# EAGLE design Interlock (EAGLE 6.6.0)
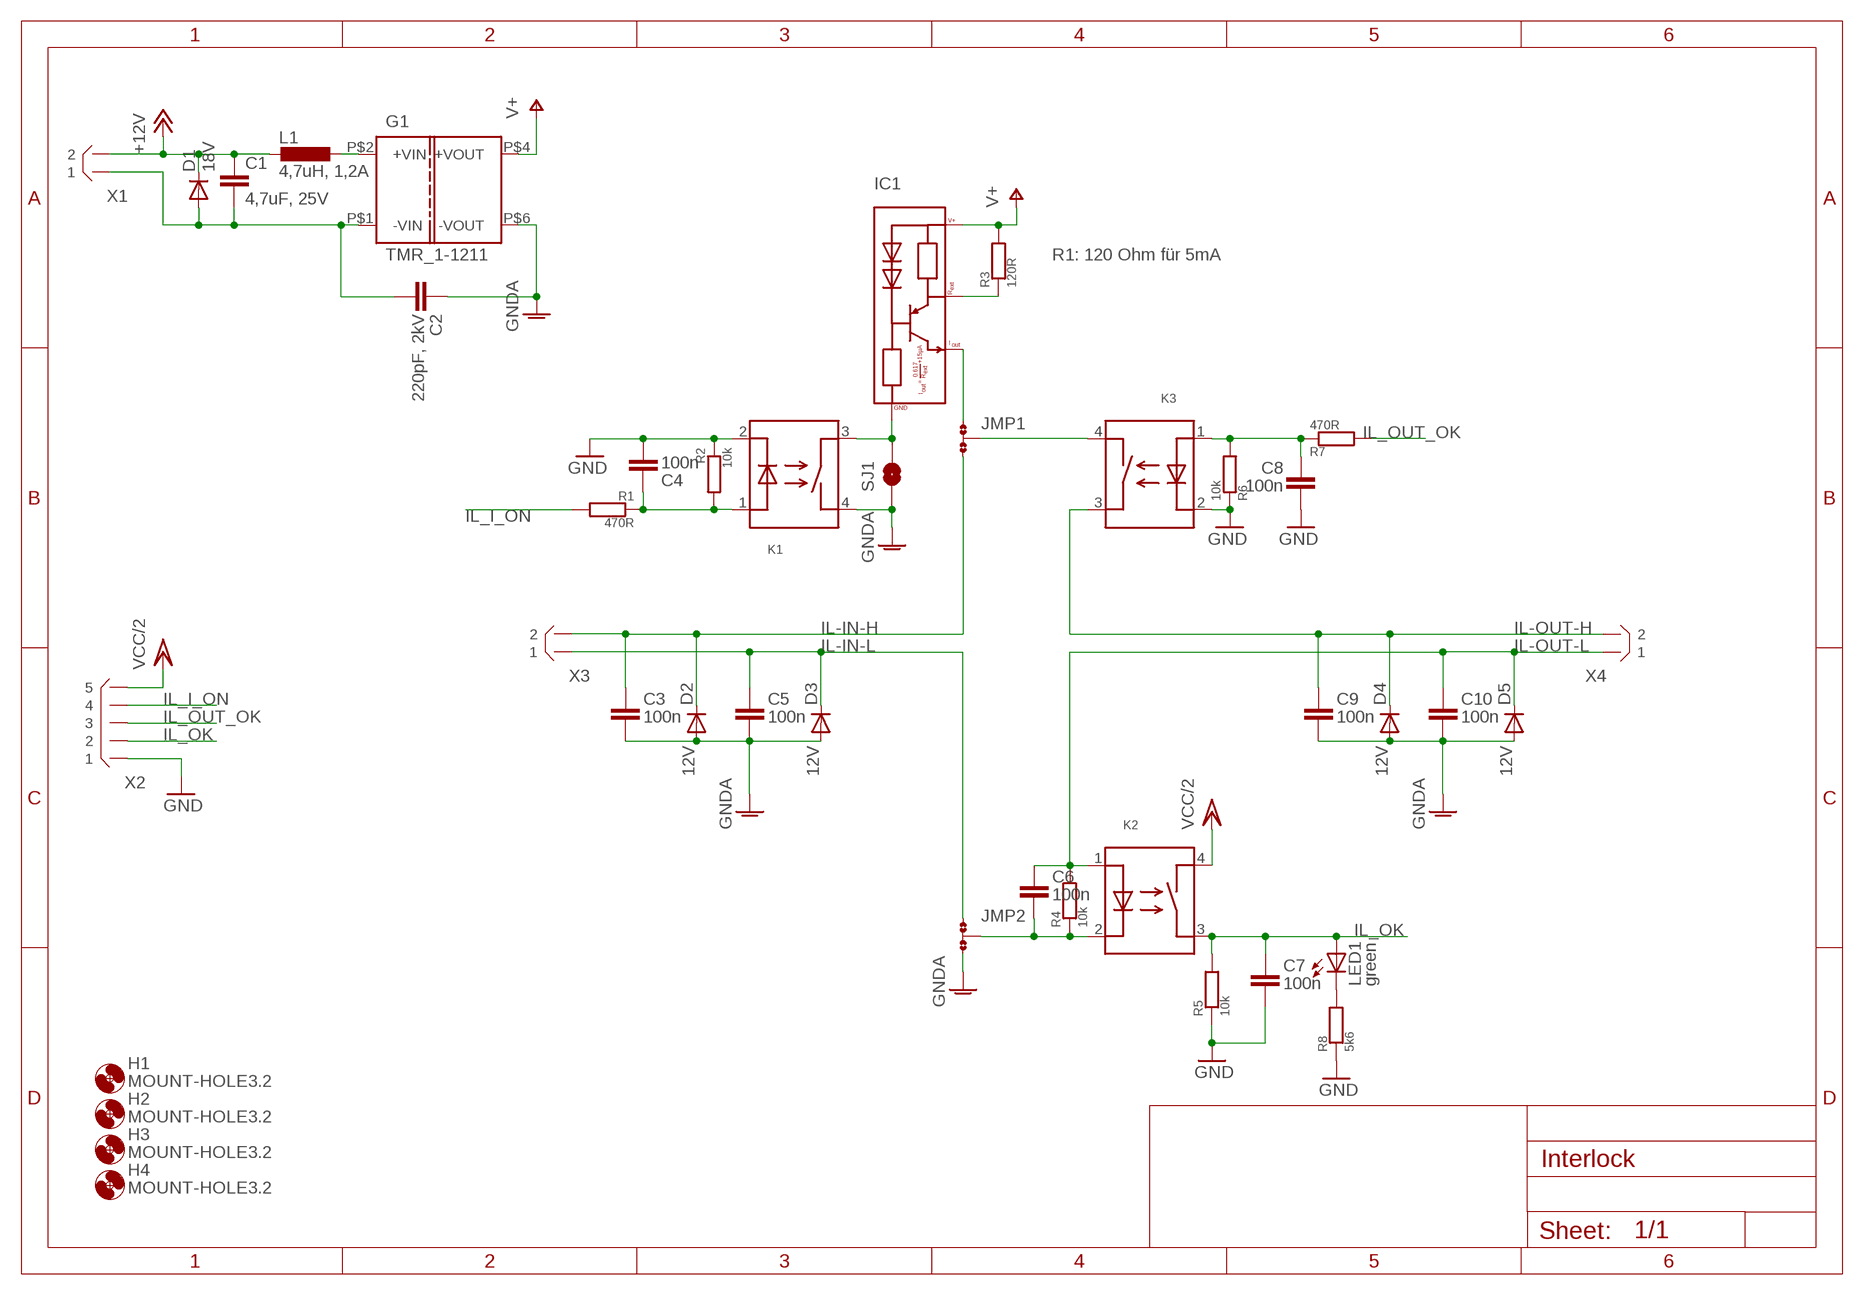
[diagram p0: schematic, sheet 1]

## Parts
C1  4,7uF, 25V  C-EUC0805  [C0805]
C2  220pF, 2kV  CC1210_HV  [C1210_HV]
C3  100n  CSTD  [C0805]
C4  100n  CSTD  [C0805]
C5  100n  CSTD  [C0805]
C6  100n  CSTD  [C0805]
C7  100n  CSTD  [C0805]
C8  100n  CSTD  [C0805]
C9  100n  CSTD  [C0805]
C10  100n  CSTD  [C0805]
D1  18V  DIODE-DO214AA  [DO214AA]
D2  12V  DIODE-DO214AA  [DO214AA]
D3  12V  DIODE-DO214AA  [DO214AA]
D4  12V  DIODE-DO214AA  [DO214AA]
D5  12V  DIODE-DO214AA  [DO214AA]
G1  TMR_1-1211  TMR_1-1  [TMR_1-??1?]
H1  MOUNT-HOLE3.2  [3,2]
H2  MOUNT-HOLE3.2  [3,2]
H3  MOUNT-HOLE3.2  [3,2]
H4  MOUNT-HOLE3.2  [3,2]
IC1  PSSI2021SAY  [SOT353]
JMP1  0R-JUMPA  [A0R-JMP]
JMP2  0R-JUMPA  [A0R-JMP]
K1  ASSR-1218  [SO-4]
K2  ASSR-1218  [SO-4]
K3  ASSR-1218  [SO-4]
L1  4,7uH, 1,2A  L-EUL3225M  [L3225M]
LED1  green  LEDCHIPLED_0805  [CHIPLED_0805]
R1  470R  R  [R0805]
R2  10k  R  [R0805]
R3  120R  R  [R0805]
R4  10k  R  [R0805]
R5  10k  R  [R0805]
R6  10k  R  [R0805]
R7  470R  R  [R0805]
R8  5k6  R  [R0805]
SJ1  SOLDERJUMPERNO  [SJ_2S-NO]
X1  B2B-XH  [B2B-XH]
X2  B5B-XH  [B5B-XH]
X3  B2B-XH  [B2B-XH]
X4  B2B-XH  [B2B-XH]

## Nets
+12V: C1.1 D1.C L1.2 X1.P$2
GND: C4.1 C7.1 C8.1 K1.2(I-) K3.2(I-) R2.1 R5.1 R6.1 R8.1 X2.P$1
GNDA: C2.P$2 C3.1 C5.1 C9.1 C10.1 D2.A D3.A D4.A D5.A G1.P$6(-VOUT) JMP2.1 K1.4(O1) SJ1.1
IL-IN-H: C3.2 D2.C JMP1.3 X3.P$2
IL-IN-L: C5.2 D3.C JMP2.3 X3.P$1
IL-OUT-H: C9.2 D4.C K3.3(O2) X4.P$2
IL-OUT-L: C6.2 C10.2 D5.C K2.1(I+) R4.2 X4.P$1
IL_I_ON: R1.2 X2.P$4
IL_OK: C7.2 K2.3(O2) LED1.A R5.2 X2.P$2
IL_OUT_OK: R7.2 X2.P$3
N$1: IC1.4(REXT) R3.1
N$2: G1.P$2(+VIN) L1.1
N$3: C8.2 K3.1(I+) R6.2 R7.1
N$4: JMP1.2 K3.4(O1)
N$5: C1.2 C2.P$1 D1.A G1.P$1(-VIN) X1.P$1
N$6: IC1.2(IOUT) JMP1.1
N$7: C6.1 JMP2.2 K2.2(I-) R4.1
N$8: IC1.3(GND) K1.3(O2) SJ1.2
N$10: C4.2 K1.1(I+) R1.1 R2.2
N$29: LED1.C R8.2
V+: G1.P$4(+VOUT) IC1.5(VSS) R3.2
VCC/2: K2.4(O1) X2.P$5

## Notes on the sheet
- R1: 120 Ohm für 5mA

## Library data of the parts
C1 = rcl:C-EU: CAPACITOR, European symbol
C2-C10 = useful:C
D1-D5 = diode:DIODE-: DIODE
G1 = traco-power:TMR_1-??1?
H1-H4 = holes:MOUNT-HOLE: MOUNTING HOLE with drill center marker
IC1 = nxp:PSSI2021SAY
JMP1 JMP2 = jumper:0R-JUMP: SMD 0R 0805 Jumper
K1-K3 = special:ASSR-1218
L1 = rcl:L-EU: INDUCTOR, European symbol
LED1 = led:LED: LED OSRAM: - CHIPLED LG R971, LG N971, LY N971, LG Q971, LY Q971, LO R971, LY R971 LH N974, LH R974 LS Q976, LO Q976, LY Q976 LO Q996 - Hyper CHIPLED LW Q18S LB Q993, LB Q99A, LB R99A - SideLED LS A670, LO A670, LY A670, LG A670, LP A670 LB A673, LV A673, LT A673, LW A673 LH A674 LY A675 LS A676, LA A676, LO A676, LY A676, LW A676 LS A679, LY A679, LG A679 - Hyper Micro SIDELED® LS Y876, LA Y876, LO Y876, LY Y876 LT Y87S - SmartLED LW L88C, LW L88S LB L89C, LB L89S, LG L890 LS L89K, LO L89K, LY L89K LS L896, LA L896, LO L896, LY L896 - TOPLED LS T670, LO T670, LY T670, LG T670, LP T670 LSG T670, LSP T670, LSY T670, LOP T670, LYG T670 LG T671, LOG T671, LSG T671 LB T673, LV T673, LT T673, LW T673 LH T674 LS T676, LA T676, LO T676, LY T676, LB T676, LH T676, LSB T676, LW T676 LB T67C, LV T67C, LT T67C, LS T67K, LO T67K, LY T67K, LW E67C LS E67B, LA E67B, LO E67B, LY E67B, LB E67C, LV E67C, LT E67C LW T67C LS T679, LY T679, LG T679 LS T770, LO T770, LY T770, LG T770, LP T770 LB T773, LV T773, LT T773, LW T773 LH T774 LS E675, LA E675, LY E675, LS T675 LS T776, LA T776, LO T776, LY T776, LB T776 LHGB T686 LT T68C, LB T68C - Hyper Mini TOPLED® LB M676 - Mini TOPLED Santana® LG M470 LS M47K, LO M47K, LY M47K Source: http://www.osram.convergy.de LUXEON: - LUMILED® LXK2-PW12-R00, LXK2-PW12-S00, LXK2-PW14-U00, LXK2-PW14-V00 LXK2-PM12-R00, LXK2-PM12-S00, LXK2-PM14-U00 LXK2-PE12-Q00, LXK2-PE12-R00, LXK2-PE12-S00, LXK2-PE14-T00, LXK2-PE14-U00 LXK2-PB12-K00, LXK2-PB12-L00, LXK2-PB12-M00, LXK2-PB14-N00, LXK2-PB14-P00, LXK2-PB14-Q00 LXK2-PR12-L00, LXK2-PR12-M00, LXK2-PR14-Q00, LXK2-PR14-R00 LXK2-PD12-Q00, LXK2-PD12-R00, LXK2-PD12-S00 LXK2-PH12-R00, LXK2-PH12-S00 LXK2-PL12-P00, LXK2-PL12-Q00, LXK2-PL12-R00 Source: www.luxeon.com KINGBRIGHT: KA-3528ASYC Source: www.kingbright.com
R1-R8 = useful:R
SJ1 = jumper:SOLDERJUMPER: Solder Jumper Standard SMD solder jumper. Used to automate production. Two varients : Normally Open and Normally Closed are the same, but have different paste layers. NC will have a large amount of paste and should jumper during reflow.
X1 X3 X4 = con-jst-xh:?2B-XH
X2 = con-jst-xh:?5B-XH

## Board
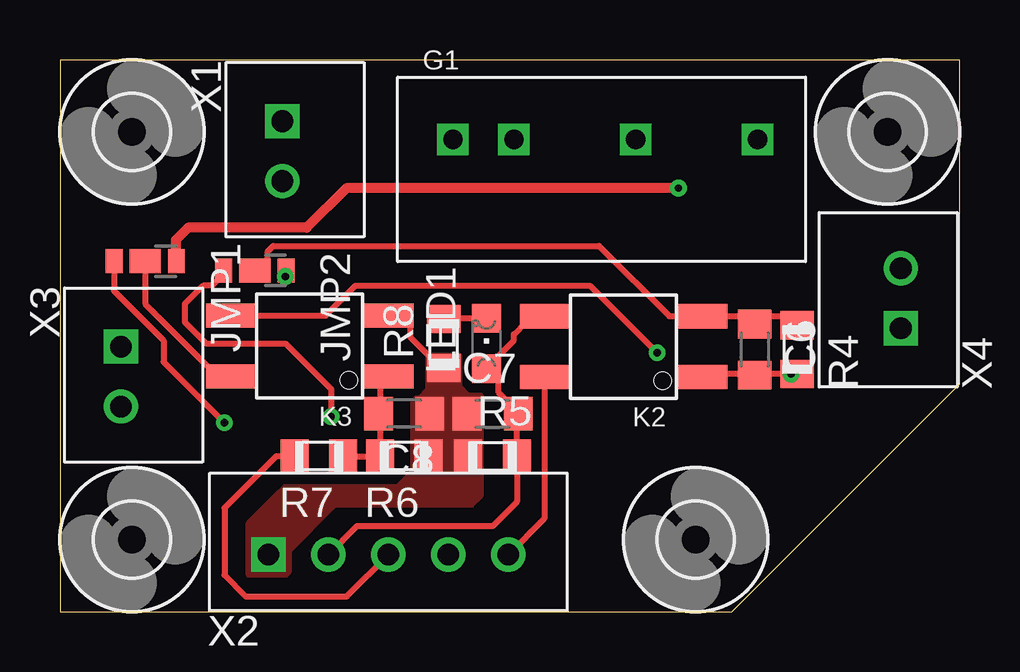
[diagram p1: board, top side]
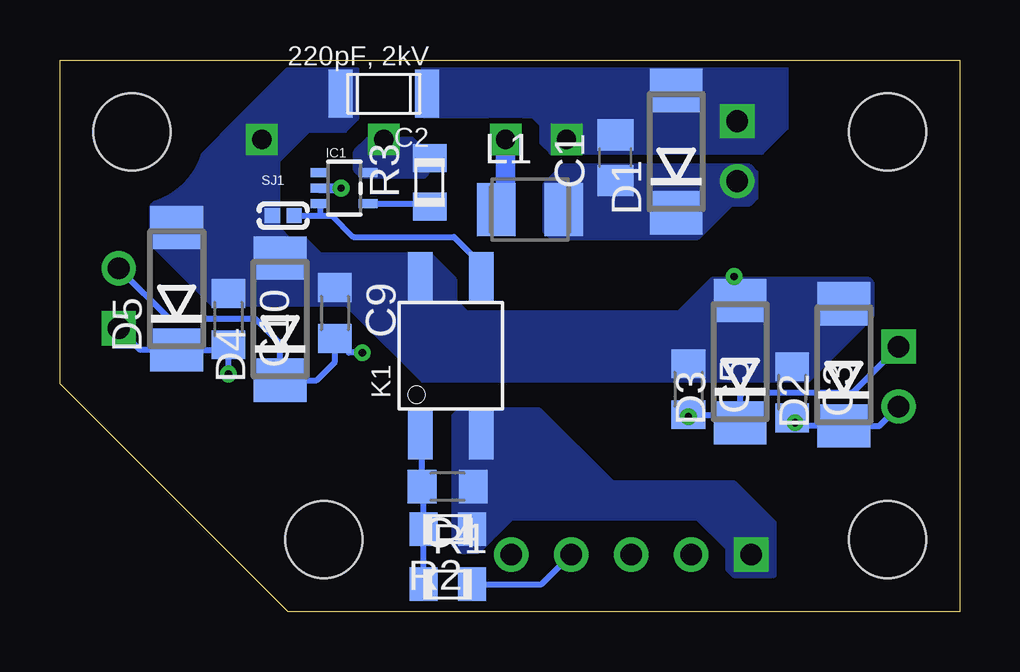
[diagram p2: board, bottom side, seen from below]

Size 37.5 x 23 mm. Coordinates in mm from the lower left corner, seen from the top.
Outline: 0,0 28,0 37.5,9.5 37.5,23 0,23 0,0
Copper layers (1+2*15+16): Top 0.035mm / dielectric 0.2mm / Route2 0.035mm / dielectric 0.5mm / Route15 0.035mm / dielectric 0.2mm / Bottom 0.035mm
Design rules "ats_35u_4layer_2 *": minimum track width 10mil, minimum drill 0.2mm, track to track 10mil, track to pad 10mil, pad to pad 10mil, via to via 10mil, smd to smd 10mil, copper to edge 0.3mm, drill to drill 8mil, minimum pad ring 10mil, minimum via ring 0.2mm, stop-mask expansion 4mil, vias tented up to drill 0mil, thermal gap 10mil

### Footprints (pad centres in the part's own frame; a part is rotated, then mirrored left to right if it is on the bottom)
C0805 = smd 1.3 x 1.5: 1 -0.95,0; 2 0.95,0
C1210_HV = smd 1 x 2: P$1 -1.8,0; P$2 1.8,0
C0805' = smd 1.2 x 1.4: 1 -1.066,0; 2 1.066,0
DO214AA = smd 1.8 x 2.2: A 2.55,0; C -2.55,0
TMR_1-??1? = drill 0.8 square: P$1 0,0; P$2 2.54,0; P$4 7.62,0; P$6 12.7,0
3,2 = hole 3.2: 0,0
SOT353 = smd 0.38 x 0.8: 1 -0.65,-1; 2 0,-1; 3 0.65,-1; 4 0.65,1; 5 -0.65,1
A0R-JMP = smd 1 x 0.7: 1 0,1.3; 3 0,-1.3 | smd 1 x 1.3: 2 0,0
SO-4 = smd 1.016 x 2.032: 1 -1.27,-3.302; 2 1.27,-3.302; 3 1.27,3.302; 4 -1.27,3.302
L3225M = smd 1.6 x 2.2: 1 -1.4,0; 2 1.4,0
CHIPLED_0805 = smd 1.2 x 1.2: A 0,-1.05; C 0,1.05
R0805 = smd 1.168 x 1.397: 1 -1.016,0; 2 1.016,0
SJ_2S-NO = smd 0.635 x 0.635: 1 -0.45,0; 2 0.45,0
B2B-XH = drill 0.9 pad 1.422 square: P$1 0,0 | drill 0.9 pad 1.422: P$2 2.5,0
B5B-XH = drill 0.9 pad 1.422 square: P$1 0,0 | drill 0.9 pad 1.422: P$2 2.5,0; P$3 5,0; P$4 7.5,0; P$5 10,0

### Placement (x,y rotation side)
C1  14.35,18.92 90 bottom
C2  24,21.59 180 bottom
C3  100n  [C0805']  6.99,9.14 270 bottom
C4  100n  [C0805']  21.34,5.21 180 bottom
C5  100n  [C0805']  11.3,9.27 270 bottom
C6  100n  [C0805']  28.96,10.92 270 top
C7  100n  [C0805']  18.03,8.26 0 top
C8  100n  [C0805']  14.35,8.26 180 top
C9  100n  [C0805']  26.04,12.45 270 bottom
C10  100n  [C0805']  30.48,12.19 270 bottom
D1  11.81,19.18 90 bottom
D2  4.83,10.29 90 bottom
D3  9.14,10.41 90 bottom
D4  28.32,12.19 90 bottom
D5  32.64,13.46 90 bottom
G1  16.38,19.68 0 top
H1  3,3 0 top
H2  26.5,3 0 top
H3  3,20 0 top
H4  34.5,20 0 top
IC1  25.65,17.65 270 bottom
JMP1  3.56,14.61 270 top
JMP2  8.13,14.22 270 top
K1  21.21,10.67 0 bottom
K2  23.5,11.05 90 top
K3  10.41,11.07 90 top
L1  17.91,16.76 0 bottom
LED1  17.78,11.18 0 top
R1  21.34,1.14 0 bottom
R2  21.34,3.43 180 bottom
R3  22.09,17.89 90 bottom
R4  30.73,10.92 270 top
R5  18.03,6.48 0 top
R6  14.35,6.48 180 top
R7  10.79,6.48 180 top
R8  16,11.18 90 top
SJ1  28.19,16.51 0 bottom
X1  9.27,20.45 270 top
X2  8.69,2.37 0 top
X3  2.54,11.05 270 top
X4  35.05,11.81 90 top

### Tracks (layer width: path | path; a pad name or v marks a point on that pad's centre or on a via)
+12V
  pour Bottom (isolate 0.254, no thermals): 8.76,18.54 16.51,18.54 17.27,17.78 17.27,15.88 17.02,15.62 10.92,15.62 9.53,17.02 8.76,17.02 8.51,17.27 8.51,18.29
GND
  Top 0.254: R8.1 15.88,10.16 14.61,11.43 14.61,12.06 14.48,12.19 13.87,12.19 K3.2
  pour Top (no thermals): 14.86,8.89 14.99,8.89 15.37,9.27 15.37,10.67 16.64,10.67 16.64,9.4 17.02,9.02 17.53,9.02 17.53,5.84 17.53,4.83 17.14,4.45 11.43,4.45 9.53,2.54 9.53,1.65 9.4,1.52 7.87,1.52 7.87,3.68 9.02,4.83 9.4,5.21 14.1,5.21 14.73,5.84 14.73,8.76
  pour Bottom (no thermals): 7.75,1.52 7.75,3.68 9.4,5.33 14.48,5.33 17.53,8.38 20.83,8.38 21.08,8.13 21.08,2.79 20.83,2.54 20.07,2.54 18.67,3.94 10.92,3.94 9.65,2.67 9.65,1.78 9.4,1.52
GNDA  (via drill 0.3)
  Top 0.254: JMP2.1 v9.4,13.97
  Bottom 0.254: v9.4,13.97 9.4,13.22 D3.A
  pour Bottom (no thermals): 3.68,13.72 3.68,12.32 6.35,9.65 22.35,9.65 25.15,12.45 25.53,12.83 31.11,12.83 33.66,15.37 33.66,16.89 27.81,22.73 25.27,22.73 25.15,22.61 25.15,20.57 25.65,20.07 26.92,20.07 27.18,20.07 28.45,18.8 28.45,16 27.94,15.49 27.3,15.49 26.67,14.86 22.1,14.86 21.08,13.84 21.08,12.95 20.57,12.45 19.56,12.45 11.68,12.45 10.29,13.84 3.81,13.84
IL-IN-H  (via drill 0.3)
  Top 0.254: JMP1.3 2.26,13.37 4.32,11.3 4.32,10.41 v6.86,7.87
  Bottom 0.254: C3.2 6.93,8.13 v6.86,7.87 6.47,7.74 D2.C 3.35,7.74 X3.P$2
IL-IN-L  (via drill 0.3)
  Top 0.254: JMP2.3 6.83,14.07 6.35,13.59 5.97,13.59 5.21,12.83 5.21,12.06 6.1,11.18 9.4,11.18 11.3,9.27 v11.3,8.13
  Bottom 0.254: X3.P$1 4.45,9.14 9.02,9.14 9.14,9.02 D3.C 9.48,8.21 C5.2 v11.3,8.13
IL-OUT-H  (via drill 0.3)
  Top 0.254: K3.3 11.07,12.34 12.32,13.59 22.1,13.59 v24.89,10.79
  Bottom 0.254: X4.P$2 32.93,12.19 29.34,12.19 28.32,11.18 D4.C 26.81,9.64 26.04,10.41 C9.2 25.45,10.79 v24.89,10.79
IL-OUT-L  (via drill 0.3)
  Top 0.254: 28.96,9.91 R4.2 30.48,9.65 v30.48,9.91 | 28.96,9.91 26.92,9.91 K2.1 | C6.2 28.96,9.91
  Bottom 0.254: v30.48,9.91 C10.2 30.82,10.91 D5.C 34.15,10.91 X4.P$1
IL_I_ON
  Bottom 0.254: R1.2 17.42,1.14 X2.P$4
IL_OK
  Top 0.254: K2.3 19.94,12.06 19.43,12.06 18.92,11.56 18.92,11.3 17.78,10.16 LED1.A 18.29,9.62 18.29,9.14 19.1,8.33 C7.2 19.05,8.21 R5.2 19.05,4.57 18.03,3.56 12.37,3.56 X2.P$2
IL_OUT_OK
  Top 0.254: R7.2 9.02,6.48 6.86,4.32 6.86,1.52 7.75,0.64 11.95,0.64 X2.P$3
N$1
  Bottom 0.254: IC1.4 22.21,17 R3.1
N$2
  Bottom 0.813: L1.1 18.92,16.76 G1.P$2
N$3
  Top 0.254: K3.1 13.49,9.8 13.34,9.65 13.34,8.26 | 13.34,8.26 R6.2 R7.1 | C8.2 13.34,8.26
N$4
  Top 0.254: JMP1.2 3.56,12.83 6.6,9.78 7.09,9.78 K3.4
N$5
  pour Bottom (isolate 0.254, no thermals): 7.24,22.99 22.35,22.99 22.35,20.7 17.78,20.7 17.4,20.32 17.4,19.56 17.02,19.18 8.26,19.18 7.24,20.19
N$6  (via drill 0.3)
  Top 0.406: v25.78,17.65 11.94,17.65 10.29,16 5.33,16 4.83,15.49 4.83,14.63 JMP1.1
  Bottom 0.406: IC1.2 v25.78,17.65
N$7
  Top 0.254: 28.96,12.32 K2.2 25.4,12.32 22.48,15.24 8.89,15.24 8.64,14.99 8.64,14.35 JMP2.2 | 28.96,12.32 30.35,12.32 R4.1 | C6.1 28.96,12.32
N$8
  Bottom 0.254: SJ1.2 26.67,16.51 | 26.67,16.51 26.16,16.51 25.27,15.62 21.08,15.62 20.19,14.73 20.19,14.22 K1.3 | IC1.3 26.65,16.53 26.67,16.51
N$10
  Bottom 0.254: R1.1 R2.2 22.35,5.16 C4.2 22.4,7.29 K1.1
N$29
  Top 0.254: LED1.C 16.04,12.23 R8.2
V+
  pour Bottom (no thermals): 22.86,19.68 22.23,19.18 22.23,18.29 22.35,18.16 24.89,18.16 25.15,18.41 25.15,19.18 24.64,19.68
VCC/2
  Top 0.254: K2.4 20.19,3.88 X2.P$5